# Altium schematic sheet Mechanical.SchDoc
size Letter; Author: Adam Gilbert; CompanyName: McGill University; DrawnBy: Adam Gilbert; Organization: Altium Limited; Address1: McGill Cosmology; Address2: 3600 University Street; Address3: Montreal, Quebec; Address4: Canada; DocumentNumber: 15; Revision: Rev2; SheetNumber: 15; SheetTotal: 16; ProjectTitle: DfMux FMC Mezz; ModelNumber: MGMEZZ04; ProjectName: DfMux FMC Mezz
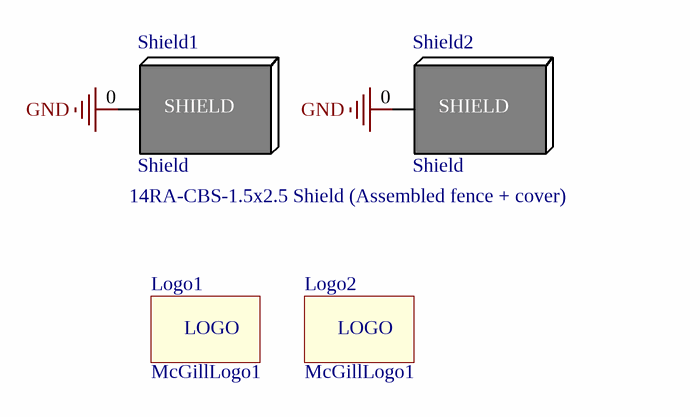
[diagram p0: Mechanical.SchDoc]

## Parts
Logo1  McGillLogo1  [McGillLogo1]  (no BOM)
Logo2  McGillLogo1  [McGillLogo1]  (no BOM)
Shield1  Shield  [14RA-CBS-1.5x2.5 Shield]
Shield2  Shield  [14RA-CBS-1.5x2.5 Shield]

## Nets
GND: Shield1.0(Ground) Shield2.0(Ground)

## Notes on the sheet
- File:
- Size:
- Date:
- Letter
- Revision:
- Sheet
- of
- Cosmology
- Drawn by:
- (in symbol 14RA-CBS-1.5x2.5) SHIELD

## Library data of the parts
Logo1 Logo2 = Logo: Assembly Comments: none
Shield1 Shield2 = 14RA-CBS-1.5x2.5: 14RA-CBS-1.5x2.5 Shield (Assembled fence + cover); Manufacturer: Leadertech; Assembly Comments: none; Supplier 1: Leadertech; Supplier Part Number 1: 14RA-CBS-1.5x2.5 Shield (Assembled fence + cover); Part Constraints: 14RA-CBS-1.5x2.5 Shield (Assembled fence + cover); Manufacturer Part Number 1: 14RA-CBS-1.5x2.5 Shield (Assembled fence + cover)